# EAGLE design LightSensorCircuitNoAmp_BTSeriesHookup (EAGLE 9.5.1)
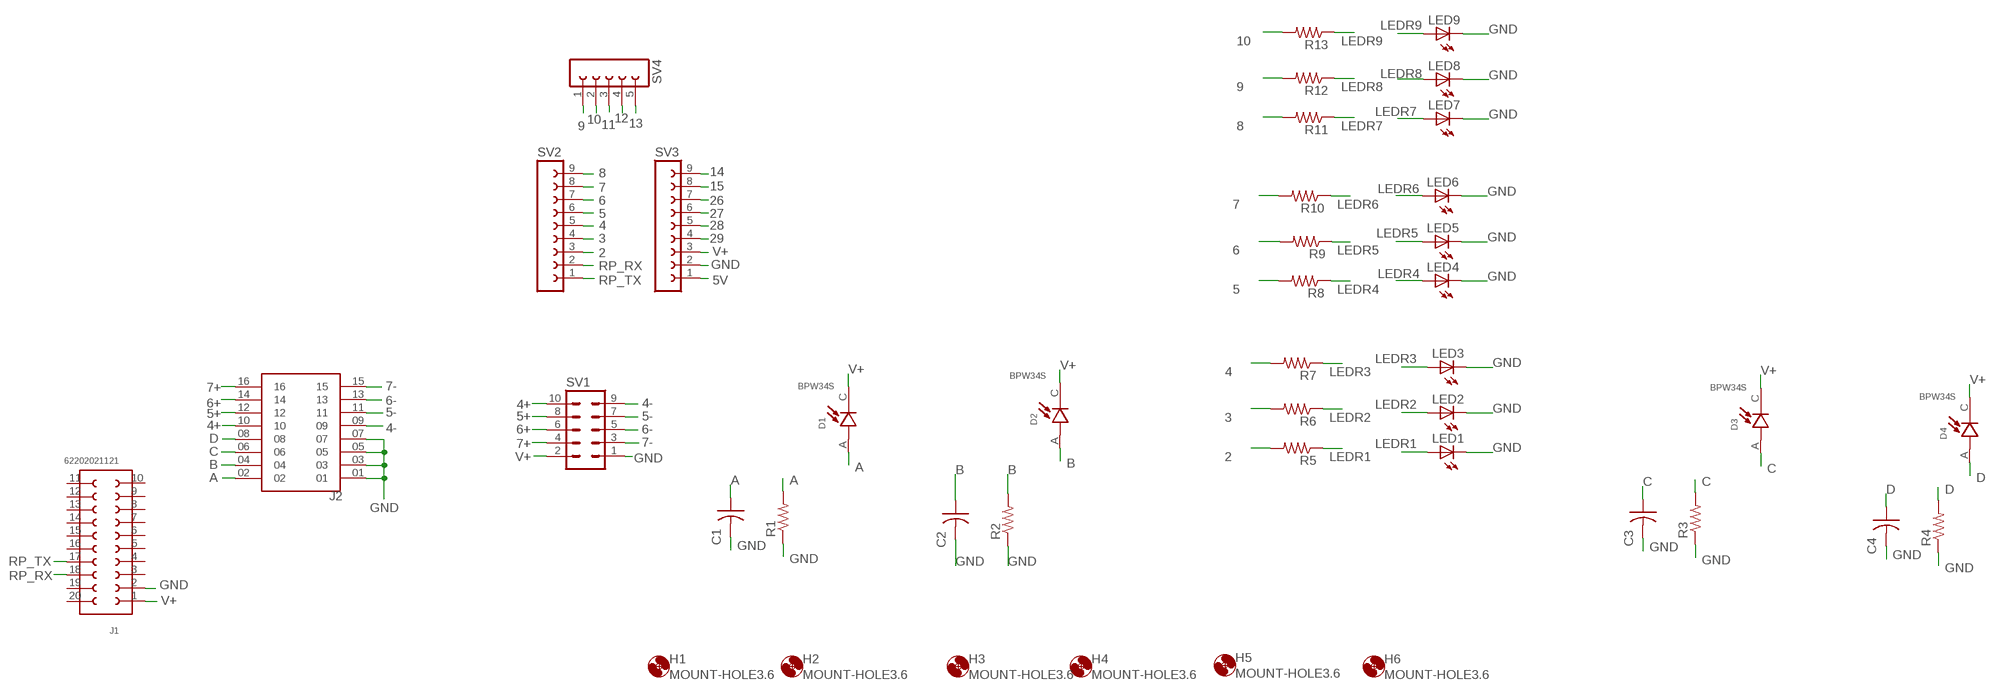
[diagram p0: schematic, sheet 1]

## Parts
C1  C-US025-025X050  [C025-025X050]
C2  C-US025-025X050  [C025-025X050]
C3  C-US025-025X050  [C025-025X050]
C4  C-US025-025X050  [C025-025X050]
D1  BPW34S  [DIO_BPW34S]
D2  BPW34S  [DIO_BPW34S]
D3  BPW34S  [DIO_BPW34S]
D4  BPW34S  [DIO_BPW34S]
H1  MOUNT-HOLE3.6  [3,6]
H2  MOUNT-HOLE3.6  [3,6]
H3  MOUNT-HOLE3.6  [3,6]
H4  MOUNT-HOLE3.6  [3,6]
H5  MOUNT-HOLE3.6  [3,6]
H6  MOUNT-HOLE3.6  [3,6]
J1  62202021121  [62202021121]
J2  FTSH-108-02-LM-D-ES  [SAMTEC_FTSH-108-02-LM-D-ES]
LED1  LEDCHIPLED_1206  [CHIPLED_1206]
LED2  LEDCHIPLED_1206  [CHIPLED_1206]
LED3  LEDCHIPLED_1206  [CHIPLED_1206]
LED4  LEDCHIPLED_1206  [CHIPLED_1206]
LED5  LEDCHIPLED_1206  [CHIPLED_1206]
LED6  LEDCHIPLED_1206  [CHIPLED_1206]
LED7  LEDCHIPLED_1206  [CHIPLED_1206]
LED8  LEDCHIPLED_1206  [CHIPLED_1206]
LED9  LEDCHIPLED_1206  [CHIPLED_1206]
R1  R-US_0204/5  [0204/5]
R2  R-US_0204/5  [0204/5]
R3  R-US_0204/5  [0204/5]
R4  R-US_0204/5  [0204/5]
R5  R-US_0204/5  [0204/5]
R6  R-US_0204/5  [0204/5]
R7  R-US_0204/5  [0204/5]
R8  R-US_0204/5  [0204/5]
R9  R-US_0204/5  [0204/5]
R10  R-US_0204/5  [0204/5]
R11  R-US_0204/5  [0204/5]
R12  R-US_0204/5  [0204/5]
R13  R-US_0204/5  [0204/5]
SV1  MA05-2  [MA05-2]
SV2  FE09-1  [FE09]
SV3  FE09-1  [FE09]
SV4  FE05-1  [FE05-1]

## Nets
2: R5.2 SV2.3
3: R6.2 SV2.4
4: R7.2 SV2.5
4+: J2.10 SV1.10
4-: J2.09 SV1.9
5: R8.2 SV2.6
5+: J2.12 SV1.8
5-: J2.11 SV1.7
5V: SV3.1
6: R9.2 SV2.7
6+: J2.14 SV1.6
6-: J2.13 SV1.5
7: R10.2 SV2.8
7+: J2.16 SV1.4
7-: J2.15 SV1.3
8: R11.2 SV2.9
9: R12.2 SV4.1
10: R13.2 SV4.2
11: SV4.3
12: SV4.4
13: SV4.5
14: SV3.9
15: SV3.8
26: SV3.7
27: SV3.6
28: SV3.5
29: SV3.4
A: C1.1 D1.A J2.02 R1.2
B: C2.1 D2.A J2.04 R2.2
C: C3.1 D3.A J2.06 R3.2
D: C4.1 D4.A J2.08 R4.2
GND: C1.2 C2.2 C3.2 C4.2 J1.2 J2.01 J2.03 J2.05 J2.07 LED1.C LED2.C LED3.C LED4.C LED5.C LED6.C LED7.C LED8.C LED9.C R1.1 R2.1 R3.1 R4.1 SV1.1 SV3.2
LEDR1: LED1.A R5.1
LEDR2: LED2.A R6.1
LEDR3: LED3.A R7.1
LEDR4: LED4.A R8.1
LEDR5: LED5.A R9.1
LEDR6: LED6.A R10.1
LEDR7: LED7.A R11.1
LEDR8: LED8.A R12.1
LEDR9: LED9.A R13.1
RP_RX: J1.18 SV2.2
RP_TX: J1.17 SV2.1
V+: D1.C D2.C D3.C D4.C J1.1 SV1.2 SV3.3
Unconnected: J1.3 J1.4 J1.5 J1.6 J1.7 J1.8 J1.9 J1.10 J1.11 J1.12 J1.13 J1.14 J1.15 J1.16 J1.19 J1.20

## Library data of the parts
C1-C4 = adafruit:C-US: CAPACITOR, American symbol
D1-D4 = BPW34S:BPW34S: PHOTODIODE; Wavelength Typ: 850nm; Sensitivity: 0.62A/W; Half Angle: 60°; Dark Current: 2nA; No. of Pins: 2; Check availability <https://pricing.snapeda.com/parts/BPW34S/Vishay%20Semiconductor%20Opto%20Division/view-part?ref=eda>; AVAILABILITY: In Stock; DESCRIPTION: Photodiode 900nm - 130° 2-DIP; MF: Vishay Semiconductor Opto Division; MP: BPW34S; PACKAGE: None; PRICE: None; PURCHASE-URL: https://pricing.snapeda.com/search/part/BPW34S/?ref=eda
H1-H6 = holes:MOUNT-HOLE: MOUNTING HOLE with drill center marker
J1 = 2x10_1.27mm:62202021121: WR-PHD 1.27mm Dual Pin Header, 20 Pins=>Code : Con_BTB_PHD_1.27_2_62202021121 <http://katalog.we-online.de/media/thumbs2/eican/thb_Con_BTB_PHD_1.27_2_6220xx21121_pf2.jpg> Details see: http://katalog.we-online.de/en/em/622_0xx_211_21 Created 2014-06-03, Karrer Zheng 2014 (C) Würth Elektronik Check availability <https://pricing.snapeda.com/parts/62202021121/W%C3%BCrth%20Elektronik/view-part?ref=eda>; AVAILABILITY: In Stock; DESCRIPTION: Connector Header Through Hole 20 position 0.050 (1.27mm); MF: Würth Elektronik; MP: 62202021121; PACKAGE: None; PRICE: None; PURCHASE-URL: https://pricing.snapeda.com/search/part/62202021121/?ref=eda
J2 = 16pos1.27mm:FTSH-108-02-LM-D-ES: Check availability <https://pricing.snapeda.com/parts/FTSH-108-02-LM-D-ES/Samtec/view-part?ref=eda>; AVAILABILITY: In Stock; DESCRIPTION: Connector Header Through Hole 16 position 0.050 (1.27mm); MF: Samtec; MP: FTSH-108-02-LM-D-ES; PACKAGE: None; PRICE: None; PURCHASE-URL: https://pricing.snapeda.com/search?q=FTSH-108-02-LM-D-ES&ref=eda
LED1-LED9 = adafruit:LED: LED OSRAM: - CHIPLED LG R971, LG N971, LY N971, LG Q971, LY Q971, LO R971, LY R971 LH N974, LH R974 LS Q976, LO Q976, LY Q976 LO Q996 - Hyper CHIPLED LW Q18S LB Q993, LB Q99A, LB R99A - SideLED LS A670, LO A670, LY A670, LG A670, LP A670 LB A673, LV A673, LT A673, LW A673 LH A674 LY A675 LS A676, LA A676, LO A676, LY A676, LW A676 LS A679, LY A679, LG A679 - Hyper Micro SIDELED® LS Y876, LA Y876, LO Y876, LY Y876 LT Y87S - SmartLED LW L88C, LW L88S LB L89C, LB L89S, LG L890 LS L89K, LO L89K, LY L89K LS L896, LA L896, LO L896, LY L896 - TOPLED LS T670, LO T670, LY T670, LG T670, LP T670 LSG T670, LSP T670, LSY T670, LOP T670, LYG T670 LG T671, LOG T671, LSG T671 LB T673, LV T673, LT T673, LW T673 LH T674 LS T676, LA T676, LO T676, LY T676, LB T676, LH T676, LSB T676, LW T676 LB T67C, LV T67C, LT T67C, LS T67K, LO T67K, LY T67K, LW E67C LS E67B, LA E67B, LO E67B, LY E67B, LB E67C, LV E67C, LT E67C LW T67C LS T679, LY T679, LG T679 LS T770, LO T770, LY T770, LG T770, LP T770 LB T773, LV T773, LT T773, LW T773 LH T774 LS E675, LA E675, LY E675, LS T675 LS T776, LA T776, LO T776, LY T776, LB T776 LHGB T686 LT T68C, LB T68C - Hyper Mini TOPLED® LB M676 - Mini TOPLED Santana® LG M470 LS M47K, LO M47K, LY M47K Source: http://www.osram.convergy.de/
R1-R13 = adafruit:R-US_: RESISTOR, American symbol
SV1 = con-lstb:MA05-2: PIN HEADER; OC_FARNELL: unknown; OC_NEWARK: unknown
SV2 SV3 = con-lsta:FE09-1: FEMALE HEADER; OC_FARNELL: unknown; OC_NEWARK: unknown
SV4 = con-lsta:FE05-1: FEMALE HEADER; OC_FARNELL: unknown; OC_NEWARK: unknown

## Board
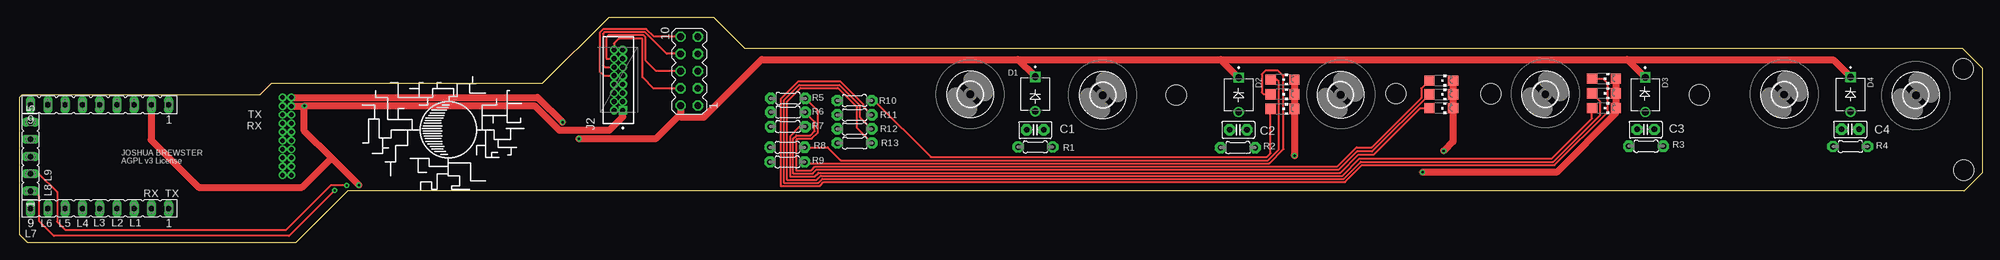
[diagram p1: board, top side]
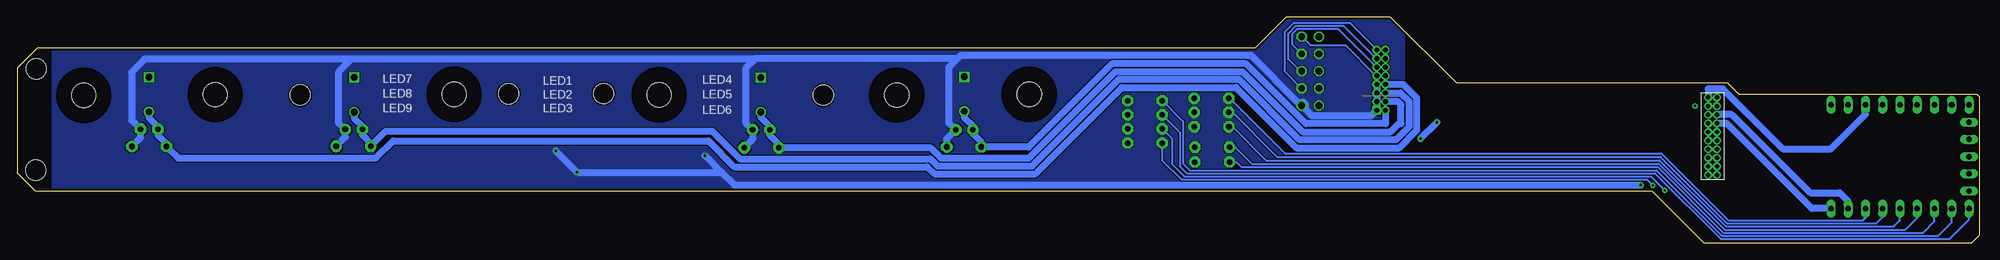
[diagram p2: board, bottom side, seen from below]

Size 288.65 x 33.25 mm. Coordinates in mm from the lower left corner, seen from the top.
Outline: 86.64,33.25 102.01,33.25 106.58,28.68 285.7,28.68 288.65,25.73 288.62,10.29 285.95,7.62 48.21,7.62 40.59,0 1.19,0 0,1.19 0,21.44 0.38,21.82 35.38,21.82 37.06,23.5 76.89,23.5 86.64,33.25
Copper layers (1*16): Top 0.035mm / dielectric 1.5mm / Bottom 0.035mm
Design rules "default *": minimum track width 6mil, minimum drill 0.35mm, track to track 6mil, track to pad 6mil, pad to pad 6mil, via to via 6mil, smd to smd 6mil, copper to edge 10mil, drill to drill 6mil, minimum pad ring 10mil, minimum via ring 8mil, stop-mask expansion 4mil, vias tented up to drill 0mil, thermal gap 10mil
Holes 3 mm at 246.99,21.77 202.36,21.97 170.08,21.74 285.88,10.67 285.83,25.6 216.33,21.92

### Footprints (pad centres in the part's own frame; a part is rotated, then mirrored left to right if it is on the bottom)
C025-025X050 = drill 0.813 pad 1.676 octagon: 1 -1.27,0; 2 1.27,0
DIO_BPW34S = drill 1 pad 1.5: A 2.55,0 | drill 1 pad 1.5 square: C -2.55,0
3,6 = hole 3.6: 0,0
62202021121 = drill 0.65: 1 -5.715,-0.635; 2 -4.445,-0.635; 3 -3.175,-0.635; 4 -1.905,-0.635; 5 -0.635,-0.635; 6 0.635,-0.635; 7 1.905,-0.635; 8 3.175,-0.635; 9 4.445,-0.635; 10 5.715,-0.635; 11 5.715,0.635; 12 4.445,0.635; 13 3.175,0.635; 14 1.905,0.635; 15 0.635,0.635; 16 -0.635,0.635; 17 -1.905,0.635; 18 -3.175,0.635; 19 -4.445,0.635; 20 -5.715,0.635
SAMTEC_FTSH-108-02-LM-D-ES = drill 0.71 pad 1.06 square: 01 0,0 | drill 0.71 pad 1.06: 02 0,1.27; 03 1.27,0; 04 1.27,1.27; 05 2.54,0; 06 2.54,1.27; 07 3.81,0; 08 3.81,1.27; 09 5.08,0; 10 5.08,1.27; 11 6.35,0; 12 6.35,1.27; 13 7.62,0; 14 7.62,1.27; 15 8.89,0; 16 8.89,1.27
CHIPLED_1206 = smd 1.5 x 1.5: A 0,-1.75; C 0,1.75
0204/5 = drill 0.813 pad 1.676 octagon: 1 -2.54,0; 2 2.54,0
MA05-2 = drill 1.016 octagon: 1 -5.08,-1.27; 2 -5.08,1.27; 3 -2.54,-1.27; 4 -2.54,1.27; 5 0,-1.27; 6 0,1.27; 7 2.54,-1.27; 8 2.54,1.27; 9 5.08,-1.27; 10 5.08,1.27
FE09 = drill 0.813 long: 1 -10.16,0; 2 -7.62,0; 3 -5.08,0; 4 -2.54,0; 5 0,0; 6 2.54,0; 7 5.08,0; 8 7.62,0; 9 10.16,0
FE05-1 = drill 0.813 long: 1 -5.08,0; 2 -2.54,0; 3 0,0; 4 2.54,0; 5 5.08,0

### Placement (x,y rotation side)
C1  149.33,16.61 0 top
C2  179.2,16.63 0 top
C3  239.11,16.68 0 top
C4  269.19,16.69 0 top
D1  149.35,21.89 270 top
D2  179.26,21.78 270 top
D3  239.04,21.79 270 top
D4  269.25,21.83 270 top
H1  139.78,21.84 0 top
H2  159.28,21.74 0 top
H3  194.23,21.79 0 top
H4  224.36,21.87 0 top
H5  259.49,21.82 0 top
H6  278.84,21.69 0 top
J1  39.29,15.67 270 bottom
J2  88.67,19.51 90 top
LED1  209.04,23.88 270 top
LED2  209.04,21.84 270 top
LED3  209.04,19.81 270 top
LED4  185.7,24.03 270 top
LED5  185.7,21.87 270 top
LED6  185.7,19.71 270 top
LED7  232.97,24.16 270 top
LED8  232.97,22 270 top
LED9  232.97,19.84 270 top
R1  149.35,14.1 180 top
R2  179.14,14.01 180 top
R3  239.17,14.21 180 top
R4  269.21,14.17 180 top
R5  112.98,21.26 180 top
R6  112.97,19.22 180 top
R7  112.95,17.1 180 top
R8  112.88,14.05 180 top
R9  112.88,11.89 180 top
R10  122.76,20.93 180 top
R11  122.76,18.82 180 top
R12  122.76,16.76 180 top
R13  122.78,14.68 180 top
SV1  98.45,25.27 90 top
SV2  11.73,5.05 180 top
SV3  11.73,20.29 180 top
SV4  1.57,12.67 90 top

### Tracks (layer width: path | path; a pad name or v marks a point on that pad's centre or on a via)
2
  Bottom 0.305: SV2.3 16.81,3.66 17.14,3.33 36.98,3.33 46.83,13.17 102.17,13.17 110.26,21.26 R5.2
3
  Bottom 0.305: R6.2 109.9,19.22 103.33,12.65 46.95,12.65 37.17,2.87 15.19,2.87 14.27,3.78 SV2.4
4
  Bottom 0.305: R7.2 109.91,17.1 104.95,12.14 47.09,12.14 37.34,2.39 12.62,2.39 11.73,3.28 SV2.5
4+
  Top 0.305: SV1.10 93.25,30.35 92.13,31.47 85.81,31.47 85.29,30.95 85.29,25.22 85.93,24.59 J2.10
4-
  Bottom 0.305: J2.09 88.7,24.56 88.8,24.56 93.32,29.08 98.43,29.08 99.7,30.35 SV1.9
5
  Bottom 0.305: R8.2 109.45,14.05 107.04,11.63 47.23,11.63 37.52,1.93 10.92,1.93 9.19,3.66 SV2.6
5+
  Top 0.305: SV1.8 95.15,27.81 91.95,31.01 86,31.01 85.78,30.79 85.78,26.14 86.05,25.86 J2.12
5-
  Bottom 0.305: SV1.7 101.07,29.16 101.07,30.76 100.33,31.5 94.36,31.5 88.72,25.86 J2.11
6
  Bottom 0.305: SV2.7 6.65,3.15 8.33,1.47 37.71,1.47 47.37,11.13 108.56,11.13 109.32,11.89 R9.2
6+
  Top 0.305: SV1.6 93.6,25.27 92.02,26.85 92.02,30.29 91.76,30.56 86.56,30.56 86.23,30.23 86.23,27.13 J2.14
6-
  Bottom 0.305: SV1.5 99.93,25.27 101.68,27.02 101.68,30.82 100.54,31.95 93.57,31.95 88.74,27.13 J2.13
7
  Bottom 0.305: R10.2 117.17,17.88 117.17,11.66 116.18,10.67 47.56,10.67 37.9,1.02 6.12,1.02 4.11,3.02 SV2.8
7+
  Top 0.305: SV1.4 93.22,22.73 91.57,24.38 91.57,30.05 88.09,30.05 87.4,29.36 J2.16
7-
  Bottom 0.305: SV1.3 102.21,25.22 102.21,31.06 100.86,32.41 92.66,32.41 88.67,28.42 J2.15
8
  Bottom 0.305: R11.2 117.63,16.23 117.63,11.24 116.6,10.21 47.74,10.21 38.09,0.56 4.42,0.56 1.57,3.4 SV2.9
9  (via drill 0.35)
  Top 0.305: v46.3,7.7 39.6,0.99 5,0.99 2.84,3.15 2.84,6.83 2.08,7.59 SV4.1
  Bottom 0.305: R12.2 118.82,15.37 118.82,11.61 116.97,9.75 48.36,9.75 v46.3,7.7
10  (via drill 0.35)
  Top 0.305: v48.07,8.44 45.69,8.44 39.08,1.83 6.76,1.83 5.49,3.1 5.49,7.47 2.82,10.13 SV4.2
  Bottom 0.305: R13.2 120.24,12.11 117.43,9.3 48.94,9.3 v48.07,8.44
A
  Bottom 1.016: D1.A 149.35,18.46 148.06,17.16 C1.1 148.06,16.05 146.81,14.81 R1.2 139.88,14.1 127.61,26.37 107.92,26.37 99.08,17.53 87.38,17.53 87.38,19.43 87.4,19.46 J2.02
B
  Bottom 1.016: D2.A 179.26,18.47 177.93,17.14 C2.1 177.93,15.79 176.6,14.46 R2.2 154.32,14.01 152.78,12.47 139.85,12.47 127.13,25.2 108.4,25.2 99.54,16.33 86.64,16.33 85.42,17.55 85.12,17.55 85.12,20.35 85.55,20.78 J2.04
C
  Bottom 1.016: D3.A 239.04,18.3 237.84,17.1 C3.1 237.84,15.86 236.63,14.65 R3.2 234.41,16.43 186.41,16.43 182.32,12.34 154.31,12.34 153.26,11.3 139.37,11.3 126.64,24.03 108.89,24.03 100.02,15.16 85.85,15.16 83.95,17.07 83.95,20.83 85.16,22.05 J2.06
D
  Bottom 1.016: D4.A 269.25,18.46 267.92,17.13 C4.1 267.92,15.85 266.67,14.61 R4.2 264.95,12.45 235.86,12.45 233.32,14.99 186.97,14.99 183.16,11.18 154.79,11.18 153.75,10.13 138.88,10.13 126.16,22.86 109.37,22.86 100.5,13.99 85.38,13.99 82.78,16.58 82.78,21.31 84.78,23.32 J2.08
GND  (via drill 0.35)
  Top 1.016: J2.01 88.67,18.54 86.72,16.59 79.32,16.59 75.82,20.09 41.91,20.09 v41.86,20.14 41.86,20.09 | J1.2 39.96,20.09 41.86,20.09 | LED4.C LED5.C LED6.C 187.42,19.69 187.42,12.88 v187.48,12.83 | v49.86,8.48 45.83,12.51 | 45.83,12.51 41.86,16.48 41.86,20.09 | LED1.C LED2.C LED3.C 210.79,14.88 v209.42,13.51 | LED7.C LED8.C LED9.C 234.72,19.07 226.02,10.38 v206.29,10.38 | SV3.2 19.33,20.27 19.33,15.14 26.29,8.18 41.5,8.18 45.83,12.51
  Bottom 1.016: J2.07 J2.05 J2.03 88.68,20.76 88.67,20.75 J2.01 89.48,18.69 98.22,18.69 99.2,19.67 | 100.33,20.75 107.14,27.56 149.89,27.56 150.37,27.08 | 100.33,20.75 99.77,20.19 SV1.1 99.2,19.67 | R4.1 270.46,15.47 C4.2 271.81,18.03 271.81,25.12 269.87,27.05 239.47,27.05 | R3.1 240.38,15.54 C3.2 241.4,17.69 241.4,25.12 239.47,27.05 | R1.1 151.89,15.32 C1.2 151.61,17.63 151.61,25.83 150.37,27.08 | 150.37,27.08 180.09,27.08 180.11,27.05 | 180.11,27.05 239.47,27.05 | 180.11,27.05 181.41,25.76 181.41,17.56 C2.2 180.47,15.22 R2.1 | v187.48,12.83 185.03,10.38 | v209.42,13.51 v206.29,10.38 185.03,10.38 | v49.86,8.48 183.13,8.48 185.03,10.38 | 100.33,20.75 99.52,20.75 99.19,20.42 99.19,19.69 99.2,19.67
  pour Bottom: 84.61,33.73 84.61,5.13 283.49,5.13 283.49,33.73
LEDR1
  Top 0.305: LED1.A 206.12,22.71 206.12,21.32 198.83,14.03 196.58,14.03 193.78,11.23 116.99,11.23 116.41,10.64 114.21,10.64 114.21,15.15 114.4,15.34 116.47,15.34 117.37,16.24 117.37,19.41 R5.1
LEDR2
  Top 0.305: LED2.A 198.88,13.44 196.65,13.44 193.98,10.77 117.18,10.77 116.6,10.19 113.74,10.19 113.74,15.33 114.21,15.8 116.28,15.8 116.92,16.43 116.92,17.81 R6.1
LEDR3
  Top 0.305: R7.1 114.71,17.1 113.28,15.67 113.28,9.73 116.86,9.73 117.44,10.31 194.19,10.31 196.83,12.95 199.09,12.95 205.95,19.81 LED3.A
LEDR4
  Top 0.305: R8.1 118.83,14.05 120.74,12.14 183.58,12.14 185.14,13.7 185.14,23.7 184.81,24.03 LED4.A
LEDR5
  Top 0.305: R9.1 115.62,11.68 183.77,11.68 185.85,13.77 185.85,24.54 185.03,25.36 183.23,25.36 182.67,24.8 182.67,22.14 182.93,21.87 LED5.A
LEDR6
  Top 0.305: R10.1 125.65,20.93 133.98,12.6 183.39,12.6 183.95,13.16 LED6.A
LEDR7
  Top 0.305: R11.1 124.05,20.07 124.05,20.36 120.71,23.7 114.44,23.7 111.91,21.17 111.91,8.36 117.66,8.36 118.24,8.94 194.89,8.94 197.39,11.44 225.72,11.44 233.53,19.25 233.53,23.42 232.79,24.16 LED7.A
LEDR8
  Top 0.305: R12.1 123.6,18.47 123.6,20.17 120.52,23.24 114.63,23.24 112.37,20.98 112.37,8.81 117.47,8.81 118.05,9.4 194.7,9.4 197.2,11.9 225.51,11.9 232.44,18.82 232.44,20.78 LED8.A
LEDR9
  Top 0.305: R13.1 123.14,16.87 123.14,19.96 120.31,22.78 114.82,22.78 112.83,20.79 112.83,9.27 117.2,9.27 117.79,9.86 194.51,9.86 197.04,12.38 225.28,12.38 231.22,18.32 LED9.A
RP_RX
  Bottom 1.016: SV2.2 19.35,6.1 20.6,7.34 24.92,7.34 36.42,18.85 J1.18
RP_TX
  Bottom 1.016: SV2.1 24.69,5.05 37.21,17.58 J1.17
V+  (via drill 0.35)
  Top 1.016: J1.1 39.93,21.41 76.15,21.41 79.81,17.75 v79.83,17.75 | v82.24,15.32 82.27,15.29 93.5,15.29 97.18,18.97 SV1.2 97.18,18.62 97.31,18.49 100.61,18.49 109.12,27 146.8,27 | D4.C 266.68,26.95 236.44,26.95 | 146.8,27 176.58,27 | 176.58,27 236.39,27 236.44,26.95 | D3.C 236.44,26.95 | D2.C 176.58,27 | D1.C 146.8,27
  Bottom 1.016: SV3.3 16.81,18.9 21.89,13.82 28.93,13.82 37.77,22.66 39.93,22.66 J1.1 | v82.24,15.32 79.83,17.73 v79.83,17.75

### Text on the board
tNames: TX / RX | JOSHUA BREWSTER / AGPL v3 License | L8 L9 | RX TX | L7 | L6 L5 L4 | L3 L2 L1
tDocu: The fat wires leading off the pin holes are for durability / as some copper stays under the coverlay and is more / heat resistant for soldering.